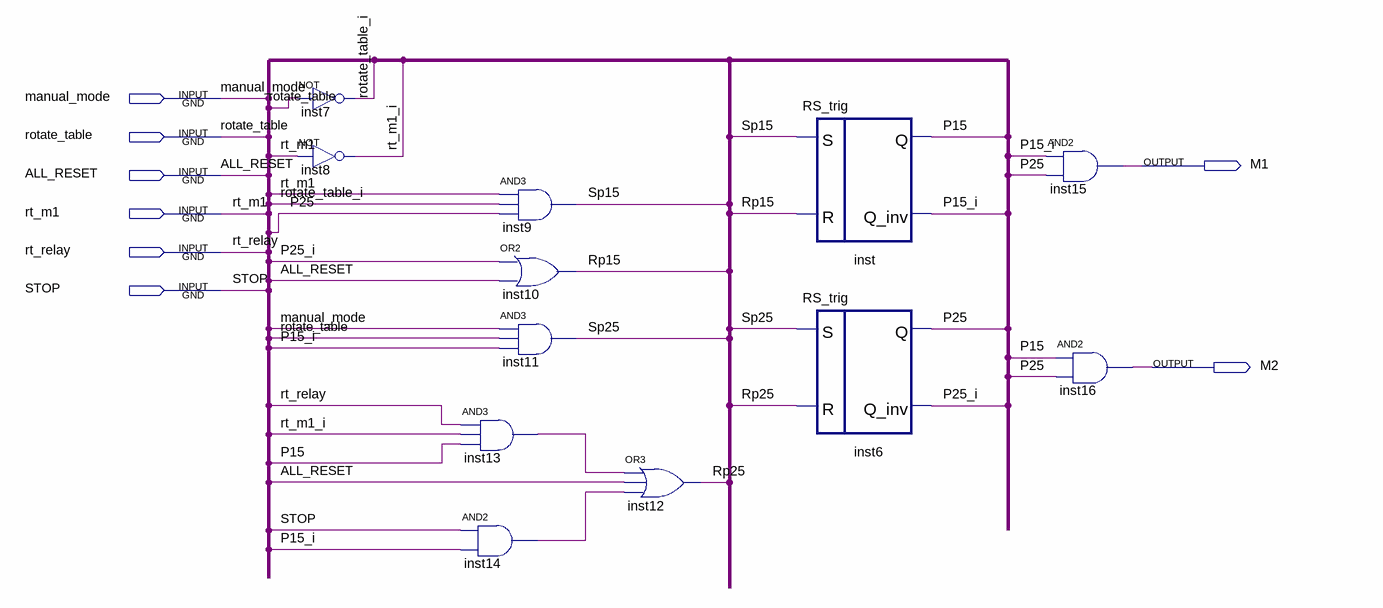
[diagram p0: schematic sheet]
// Quartus schematic manual_table.bdf as structural Verilog: 12 symbols, 8 pins
module manual_table (
  input  manual_mode,
  input  rotate_table,
  input  ALL_RESET,
  input  rt_m1,
  input  rt_relay,
  input  STOP,
  output M1,
  output M2
);

  wire inst13_out, inst14_out, P15, P15_i, P25, P25_i, rotate_table_i, Rp15, Rp25, rt_m1_i, Sp15, Sp25;

  not inst7 (rotate_table_i, rotate_table);
  not inst8 (rt_m1_i, rt_m1);
  and inst13 (inst13_out, rt_relay, rt_m1_i, P15);
  and inst14 (inst14_out, STOP, P15_i);
  and inst9 (Sp15, rt_m1, rotate_table_i, P25);
  or inst10 (Rp15, P25_i, ALL_RESET);
  and inst11 (Sp25, manual_mode, rotate_table, P15_i);
  or inst12 (Rp25, inst13_out, ALL_RESET, inst14_out);
  RS_trig inst (.S(Sp15), .R(Rp15), .Q(P15), .Q_inv(P15_i));
  RS_trig inst6 (.S(Sp25), .R(Rp25), .Q(P25), .Q_inv(P25_i));
  and inst15 (M1, P15_i, P25);
  and inst16 (M2, P15, P25);
endmodule
